# Altium project vidBoardV4.PrjPcb
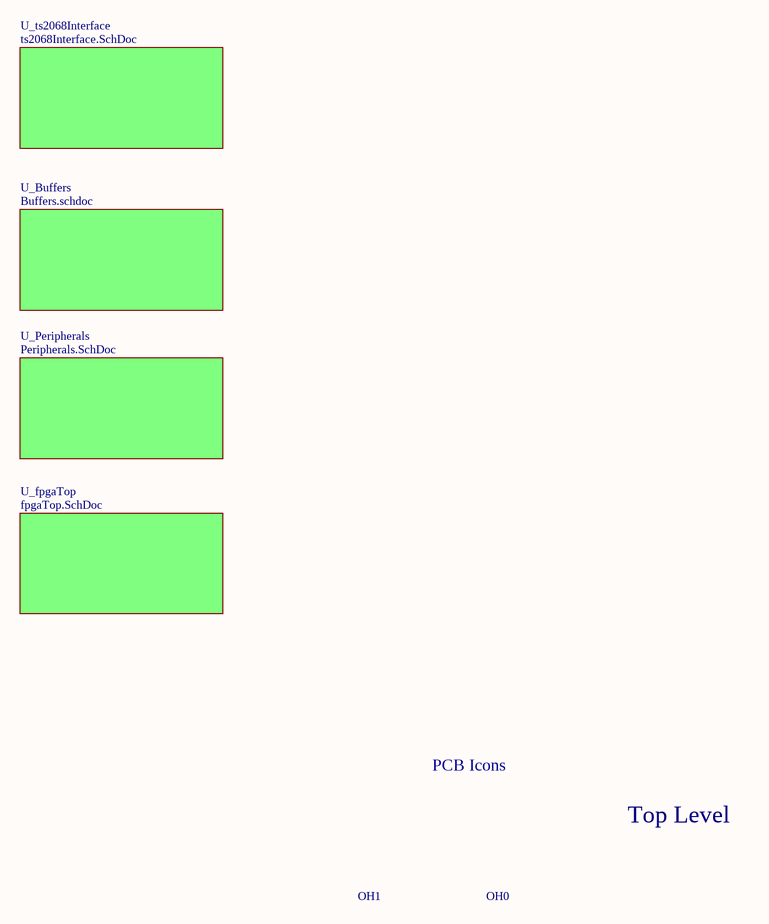
[diagram p0: vidBoardTop.SchDoc]
6 sheets, 103 parts. Net scope: global (net labels, ports and power ports of the same name join across sheets).
Sheets:
  vidBoardTop.SchDoc
    U_Peripherals = Peripherals.SchDoc
    U_ts2068Interface = ts2068Interface.SchDoc
    U_fpgaTop = fpgaTop.SchDoc
      U_fpgaPower = fpgaPower.SchDoc
      U_fpgaConfig = fpgaConfig.SchDoc

## Sheet vidBoardTop.SchDoc
size A; SheetNumber: 1; SheetTotal: 5

### Parts
OH0  OPENHW_PCB  [OpenHW]  (value not drawn)
OH1  OPENHW_SCH  (value not drawn)

### Sub-sheets
U_Buffers = Buffers.schdoc (file not in this document): no entries
U_fpgaTop = fpgaTop.SchDoc: no entries
U_Peripherals = Peripherals.SchDoc: no entries
U_ts2068Interface = ts2068Interface.SchDoc: no entries

### Notes on the sheet
- PCB Icons
- Top Level

## Sheet Peripherals.SchDoc
size A; SheetNumber: 4; SheetTotal: 5
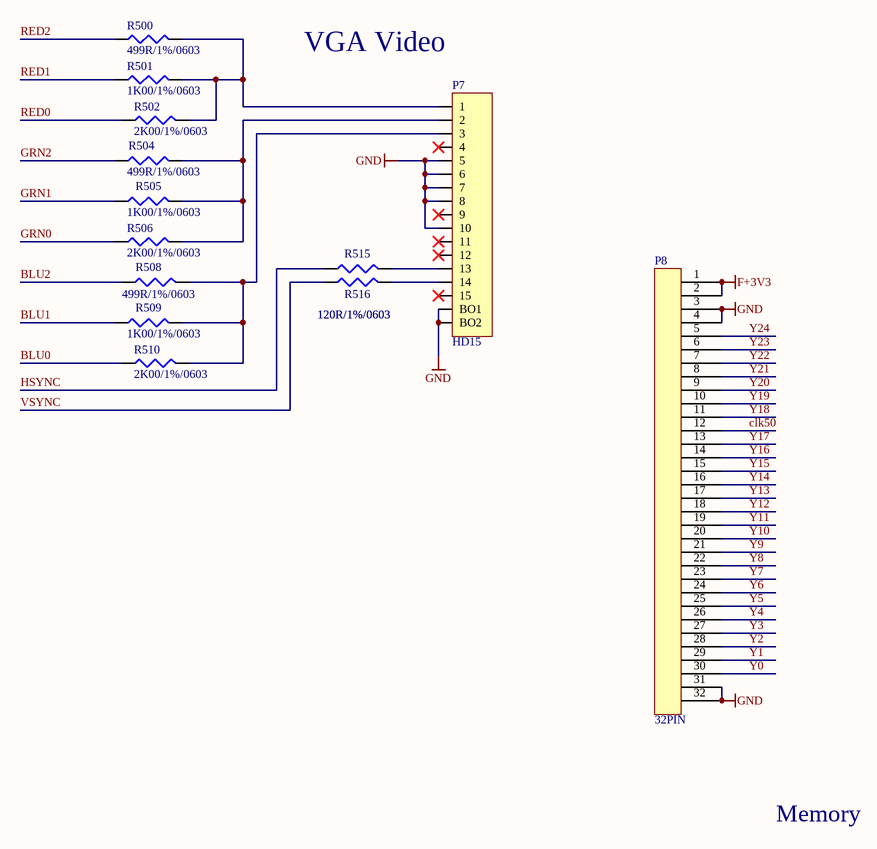
[diagram p1: Peripherals.SchDoc]

### Parts
P7  HD15  [DB15FLC]
P8  32PIN  [IDC32]
R500  499R/1%/0603  [0603]
R501  1K00/1%/0603  [0603]
R502  2K00/1%/0603  [0603]
R504  499R/1%/0603  [0603]
R505  1K00/1%/0603  [0603]
R506  2K00/1%/0603  [0603]
R508  499R/1%/0603  [0603]
R509  1K00/1%/0603  [0603]
R510  2K00/1%/0603  [0603]
R515  120R/1%/0603  [0603]
R516  120R/1%/0603  [0603]

### Nets
F+3V3: P8.1 P8.2
GND: P7.5 P7.6 P7.7 P7.8 P7.10 P7.BO1 P7.BO2 P8.3 P8.4 P8.31 P8.32
BLU0: R510.1
BLU1: R509.1
BLU2: R508.1
clk50: P8.12
GRN0: R506.1
GRN1: R505.1
GRN2: R504.1
HSYNC: R515.1
RED0: R502.1
RED1: R501.1
RED2: R500.1
VSYNC: R516.1
Y0: P8.30
Y1: P8.29
Y2: P8.28
Y3: P8.27
Y4: P8.26
Y5: P8.25
Y6: P8.24
Y7: P8.23
Y8: P8.22
Y9: P8.21
Y10: P8.20
Y11: P8.19
Y12: P8.18
Y13: P8.17
Y14: P8.16
Y15: P8.15
Y16: P8.14
Y17: P8.13
Y18: P8.11
Y19: P8.10
Y20: P8.9
Y21: P8.8
Y22: P8.7
Y23: P8.6
Y24: P8.5
NetP7_1: P7.1 R500.2 R501.2 R502.2
NetP7_2: P7.2 R504.2 R505.2 R506.2
NetP7_3: P7.3 R508.2 R509.2 R510.2
NetP7_13: P7.13 R515.2
NetP7_14: P7.14 R516.2

Not connected (* = marked no-connect by the designer): P7 4* 9* 11* 12* 15*

### Notes on the sheet
- (near P7) VGA Video
- Memory

### Library data of the parts
P7 = HD15: CONN DSUB HD RCPT 15POS R/A SLDR; Text Field1: Amphenol; Mfg PN: ICD15S13E4GX00LF; DK PN: 609-5181-ND
R500 R504 R508 = 499R/1%/0603: 499 Ohms ±1% 0.1W, 1/10W Chip Resistor 0603 (1608 Metric) Moisture Resistant Thick Film; MFG: Yeago; MFG PN: RC0603FR-07499RL; DK PN: 311-499HRCT-ND
R501 R505 R509 = 1K00/1%/0603: 1 kOhms ±1% 0.1W, 1/10W Chip Resistor 0603 (1608 Metric) Moisture Resistant Thick Film; MFG: Yeago; MFG PN: RC0603FR-071KL; DK PN: 311-1.00KHRCT-ND
R502 R506 R510 = 2K00/1%/0603: 2 kOhms ±1% 0.1W, 1/10W Chip Resistor 0603 (1608 Metric) Moisture Resistant Thick Film; MFG: Yeago; MFG PN: RC0603FR-072KL; DK PN: 311-2.00KHRCT-ND
R515 R516 = 120R/1%/0603: 120 Ohms ±1% 0.1W, 1/10W Chip Resistor 0603 (1608 Metric) Moisture Resistant Thick Film; MFG: Yaego; MFG PN: RC0603FR-07120RL; DK PN: 311-120HRCT-ND
P8 = 32PIN: MFG: *; MFG PN: *; DK PN: *; Price: *

## Sheet ts2068Interface.SchDoc
size A; SheetNumber: 2; SheetTotal: 5
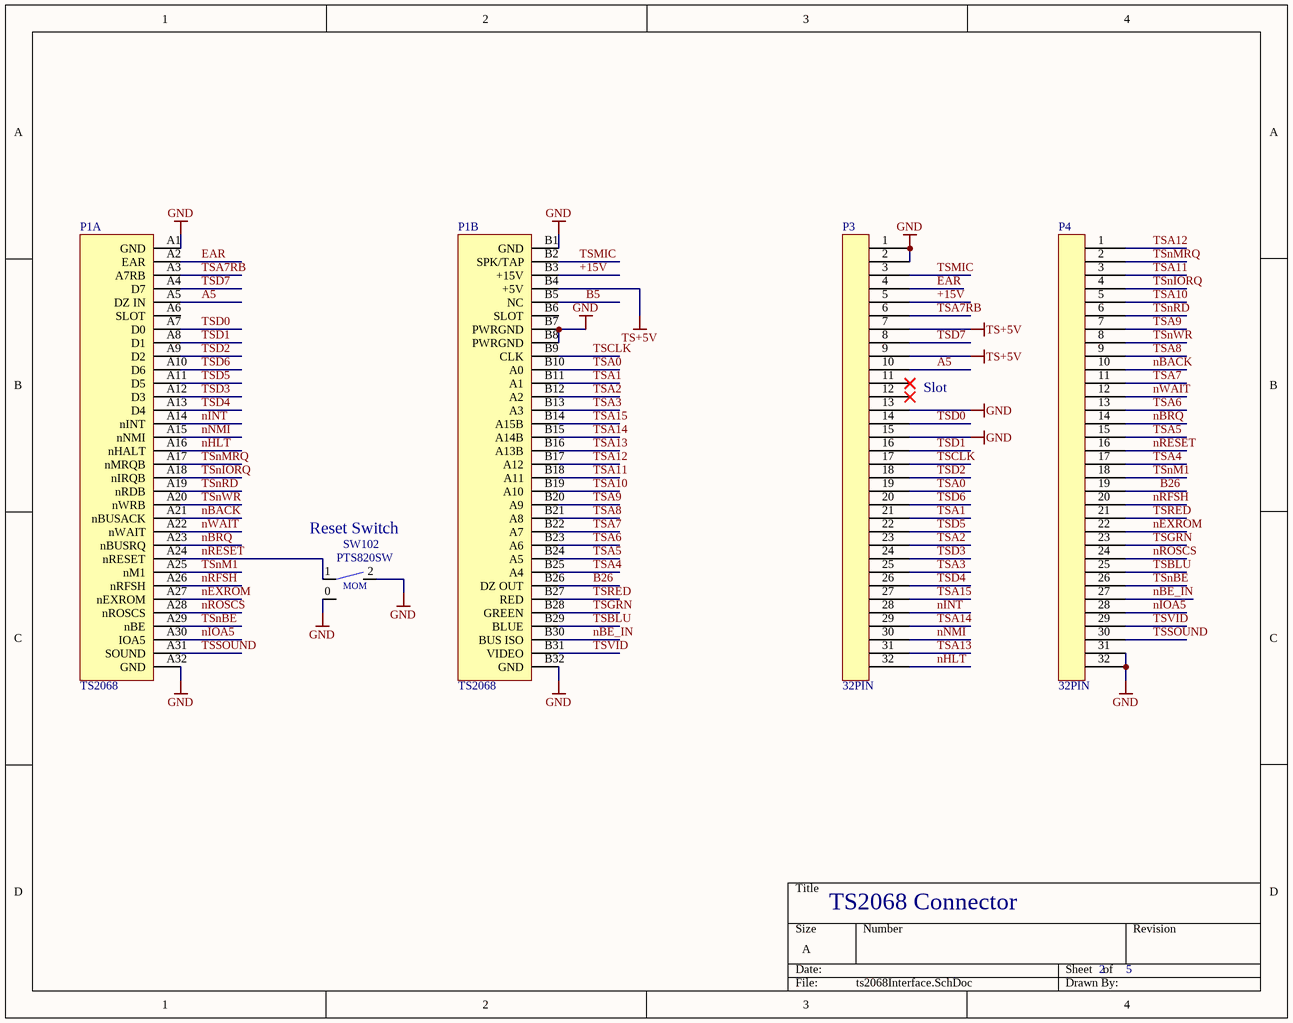
[diagram p2: ts2068Interface.SchDoc]

### Parts
P1  TS2068  [TS2068A]  (parts A,B of 2)
P3  32PIN  [IDC32]
P4  32PIN  [IDC32]
SW102  PTS820SW  [PTS820]

### Nets
GND: P1.A1(GND) P1.A32(GND) P1.B1(GND) P1.B7(PWRGND) P1.B8(PWRGND) P1.B32(GND) P3.1 P3.2 P3.13 P3.15 P4.31 P4.32 SW102.0 SW102.2
TS+5V: P1.B4(+5V) P3.7 P3.9
+15V: P1.B3(+15V) P3.5
A5: P1.A5(DZ_IN) P3.10
B5: P1.B5(NC)
B26: P1.B26(DZ_OUT) P4.19
EAR: P1.A2(EAR) P3.4
nBACK: P1.A21(nBUSACK) P4.10
nBE_IN: P1.B30(BUS_ISO) P4.27
nBRQ: P1.A23(nBUSRQ) P4.14
nEXROM: P1.A27(nEXROM) P4.22
nHLT: P1.A16(nHALT) P3.32
nINT: P1.A14(nINT) P3.28
nIOA5: P1.A30(IOA5) P4.28
nNMI: P1.A15(nNMI) P3.30
nRESET: P1.A24(nRESET) P4.16 SW102.1
nRFSH: P1.A26(nRFSH) P4.20
nROSCS: P1.A28(nROSCS) P4.24
nWAIT: P1.A22(nWAIT) P4.12
TSA0: P1.B10(A0) P3.19
TSA1: P1.B11(A1) P3.21
TSA2: P1.B12(A2) P3.23
TSA3: P1.B13(A3) P3.25
TSA4: P1.B25(A4) P4.17
TSA5: P1.B24(A5) P4.15
TSA6: P1.B23(A6) P4.13
TSA7: P1.B22(A7) P4.11
TSA7RB: P1.A3(A7RB) P3.6
TSA8: P1.B21(A8) P4.9
TSA9: P1.B20(A9) P4.7
TSA10: P1.B19(A10) P4.5
TSA11: P1.B18(A11) P4.3
TSA12: P1.B17(A12) P4.1
TSA13: P1.B16(A13B) P3.31
TSA14: P1.B15(A14B) P3.29
TSA15: P1.B14(A15B) P3.27
TSBLU: P1.B29(BLUE) P4.25
TSCLK: P1.B9(CLK) P3.17
TSD0: P1.A7(D0) P3.14
TSD1: P1.A8(D1) P3.16
TSD2: P1.A9(D2) P3.18
TSD3: P1.A12(D3) P3.24
TSD4: P1.A13(D4) P3.26
TSD5: P1.A11(D5) P3.22
TSD6: P1.A10(D6) P3.20
TSD7: P1.A4(D7) P3.8
TSGRN: P1.B28(GREEN) P4.23
TSMIC: P1.B2(SPK/TAP) P3.3
TSnBE: P1.A29(nBE) P4.26
TSnIORQ: P1.A18(nIRQB) P4.4
TSnM1: P1.A25(nM1) P4.18
TSnMRQ: P1.A17(nMRQB) P4.2
TSnRD: P1.A19(nRDB) P4.6
TSnWR: P1.A20(nWRB) P4.8
TSRED: P1.B27(RED) P4.21
TSSOUND: P1.A31(SOUND) P4.30
TSVID: P1.B31(VIDEO) P4.29

Not connected (* = marked no-connect by the designer): P1 A6(SLOT) B6(SLOT); P3 11* 12*

### Notes on the sheet
- Slot
- (near SW102) Reset Switch
- TS2068 Connector
- (in symbol PTS820SW) MOM

### Library data of the parts
SW102 = PTS820SW: Tactile Switch SPST-NO Top Actuated Surface Mount; MFG: C&K; MFG PN: PTS820 J20M SMTR LFS; DK PN: CKN10505CT-ND
P1 = TS2068: Populate: *
P3 P4 = 32PIN: MFG: *; MFG PN: *; DK PN: *; Price: *

## Sheet fpgaTop.SchDoc: FPGA Top Level
size A; SheetNumber: 1; SheetTotal: 3; PageSetup: Record=PageOptions|CenterHorizontal=True|CenterVertical=True|PrintScale=0.70|XCorrection=1.00|YCorrection=1.00|PrintKind=1|BorderSize=5000000|LeftOffset=0|BottomOffset=0|Orientation=2|PaperLength=2794|PaperWidth=2159|Scale=100|PaperSource=7|PrintQuality=600|MediaType=1|DitherType=10|PrintScaleMode=1|PaperKind=Letter|PaperIndex=1; DocumentName: Connectors
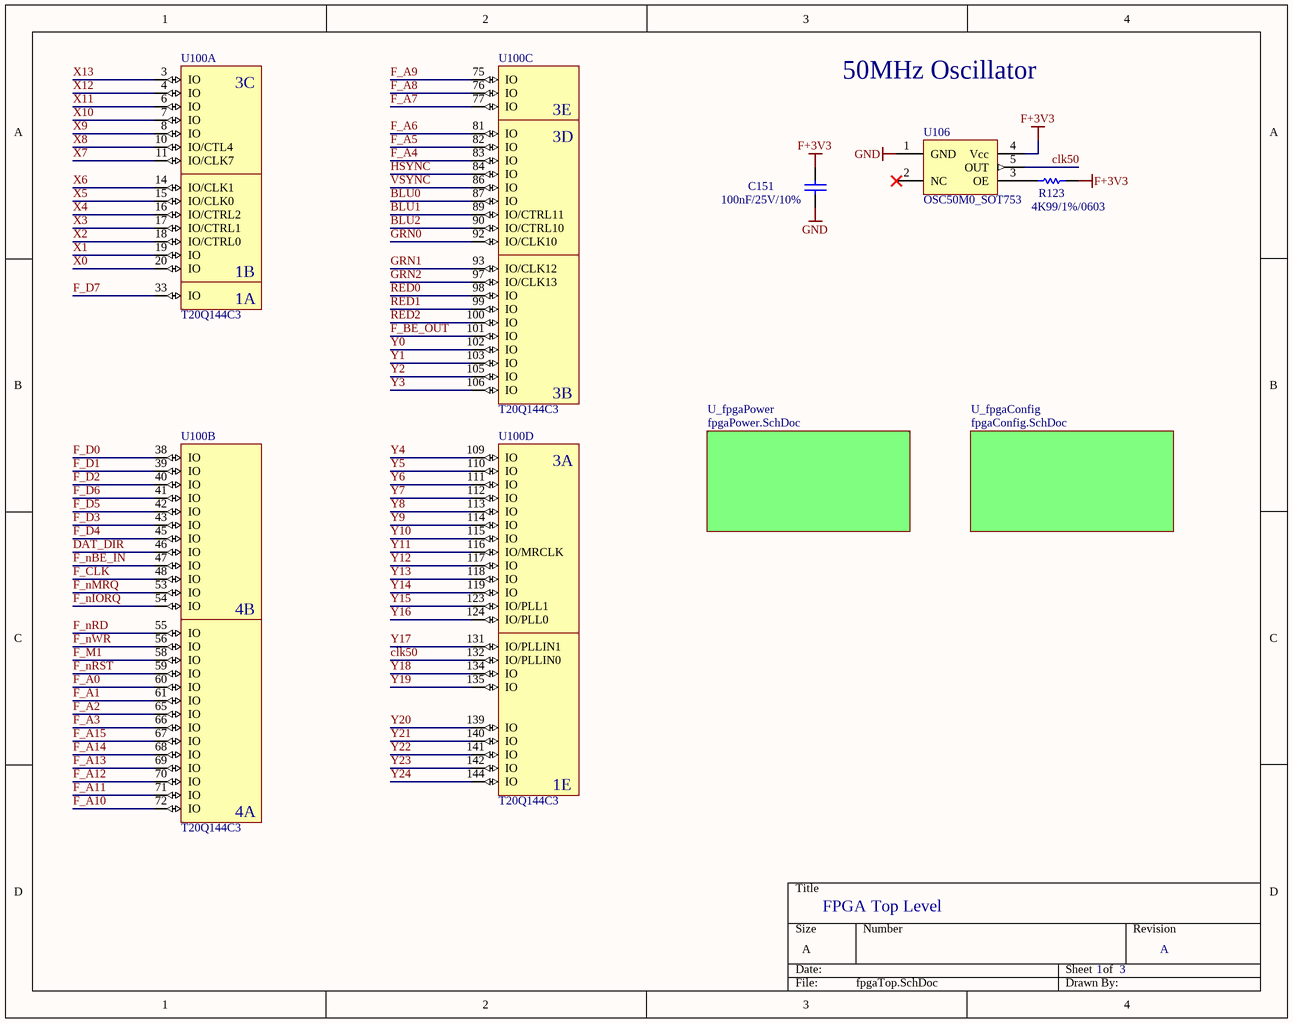
[diagram p3: fpgaTop.SchDoc]

### Parts
C151  100nF/25V/10%  [MY0603]
R123  4K99/1%/0603  [0603]
U100  T20Q144C3  [LQFP144]  (parts A,B,C,D of 6)
U106  OSC50M0_SOT753  [SOT753]

### Sub-sheets
U_fpgaConfig = fpgaConfig.SchDoc: no entries
U_fpgaPower = fpgaPower.SchDoc: no entries

### Nets
F+3V3: C151.2 R123.1 U106.4(Vcc)
GND: C151.1 U106.1(GND)
BLU0: U100.87(IO)
BLU1: U100.89(IO/CTRL11)
BLU2: U100.90(IO/CTRL10)
clk50: U100.132(IO/PLLIN0) U106.5(OUT)
DAT_DIR: U100.46(IO)
F_A0: U100.60(IO)
F_A1: U100.61(IO)
F_A2: U100.65(IO)
F_A3: U100.66(IO)
F_A4: U100.83(IO)
F_A5: U100.82(IO)
F_A6: U100.81(IO)
F_A7: U100.77(IO)
F_A8: U100.76(IO)
F_A9: U100.75(IO)
F_A10: U100.72(IO)
F_A11: U100.71(IO)
F_A12: U100.70(IO)
F_A13: U100.69(IO)
F_A14: U100.68(IO)
F_A15: U100.67(IO)
F_BE_OUT: U100.101(IO)
F_CLK: U100.48(IO)
F_D0: U100.38(IO)
F_D1: U100.39(IO)
F_D2: U100.40(IO)
F_D3: U100.43(IO)
F_D4: U100.45(IO)
F_D5: U100.42(IO)
F_D6: U100.41(IO)
F_D7: U100.33(IO)
F_M1: U100.58(IO)
F_nBE_IN: U100.47(IO)
F_nIORQ: U100.54(IO)
F_nMRQ: U100.53(IO)
F_nRD: U100.55(IO)
F_nRST: U100.59(IO)
F_nWR: U100.56(IO)
GRN0: U100.92(IO/CLK10)
GRN1: U100.93(IO/CLK12)
GRN2: U100.97(IO/CLK13)
HSYNC: U100.84(IO)
RED0: U100.98(IO)
RED1: U100.99(IO)
RED2: U100.100(IO)
VSYNC: U100.86(IO)
X0: U100.20(IO)
X1: U100.19(IO)
X2: U100.18(IO/CTRL0)
X3: U100.17(IO/CTRL1)
X4: U100.16(IO/CTRL2)
X5: U100.15(IO/CLK0)
X6: U100.14(IO/CLK1)
X7: U100.11(IO/CLK7)
X8: U100.10(IO/CTL4)
X9: U100.8(IO)
X10: U100.7(IO)
X11: U100.6(IO)
X12: U100.4(IO)
X13: U100.3(IO)
Y0: U100.102(IO)
Y1: U100.103(IO)
Y2: U100.105(IO)
Y3: U100.106(IO)
Y4: U100.109(IO)
Y5: U100.110(IO)
Y6: U100.111(IO)
Y7: U100.112(IO)
Y8: U100.113(IO)
Y9: U100.114(IO)
Y10: U100.115(IO)
Y11: U100.116(IO/MRCLK)
Y12: U100.117(IO)
Y13: U100.118(IO)
Y14: U100.119(IO)
Y15: U100.123(IO/PLL1)
Y16: U100.124(IO/PLL0)
Y17: U100.131(IO/PLLIN1)
Y18: U100.134(IO)
Y19: U100.135(IO)
Y20: U100.139(IO)
Y21: U100.140(IO)
Y22: U100.141(IO)
Y23: U100.142(IO)
Y24: U100.144(IO)
NetR123_2: R123.2 U106.3(OE)

Not connected (* = marked no-connect by the designer): U106 2(NC)*

### Notes on the sheet
- 50MHz Oscillator
- A
- (in symbol T20Q144C3, part A) 3C; 1B; 1A
- (in symbol T20Q144C3, part B) 4B; 4A
- (in symbol T20Q144C3, part C) 3E; 3D; 3B
- (in symbol T20Q144C3, part D) 3A; 1E

### Library data of the parts
C151 = CAP100NF25V: 0.1µF ±10% 25V Ceramic Capacitor X7R 0603 (1608 Metric); MFG PN: 06033C104KAT2A; DK PN: 478-3714-1-ND; MFG: AVX; FOOTPRINT: 0603; Populate: *
R123 = RES4K99: 4.99k Ohm ±1% 0.1W, 1/10W Chip Resistor 0603 (1608 Metric) Moisture Resistant Thick Film; MFG PN: RC0603FR-074K99L; DK PN: 311-4.99KHRTR-ND; MFG: Yageo; Populate: *; Comment_1: 4K99/1%/0603
U100 = T20Q144C3: Trion® Field Programmable Gate Array (FPGA) IC 97 1044 19728 144-LQFP; MFG: Efinix; DK PN: 2134-T20Q144C3-ND; MFG PN: T20Q144C3; FOOTPRINT: 144QFP; Populate: *
U106 = OSC50M0_SOT753: 50 MHz XO (Standard) HCMOS, LVCMOS Oscillator 2.5V ~ 3.3V Standby (Power Down) SC-74A, SOT-753; MFG PN: SIT2001BI-S3-XXS-50.000000; DK PN: 1473-SIT2001BI-S3-XXS-50.000000-ND; MFG: SiTime; Populate: *

## Sheet fpgaPower.SchDoc: FPGA Power
size A; SheetNumber: 3; SheetTotal: 3
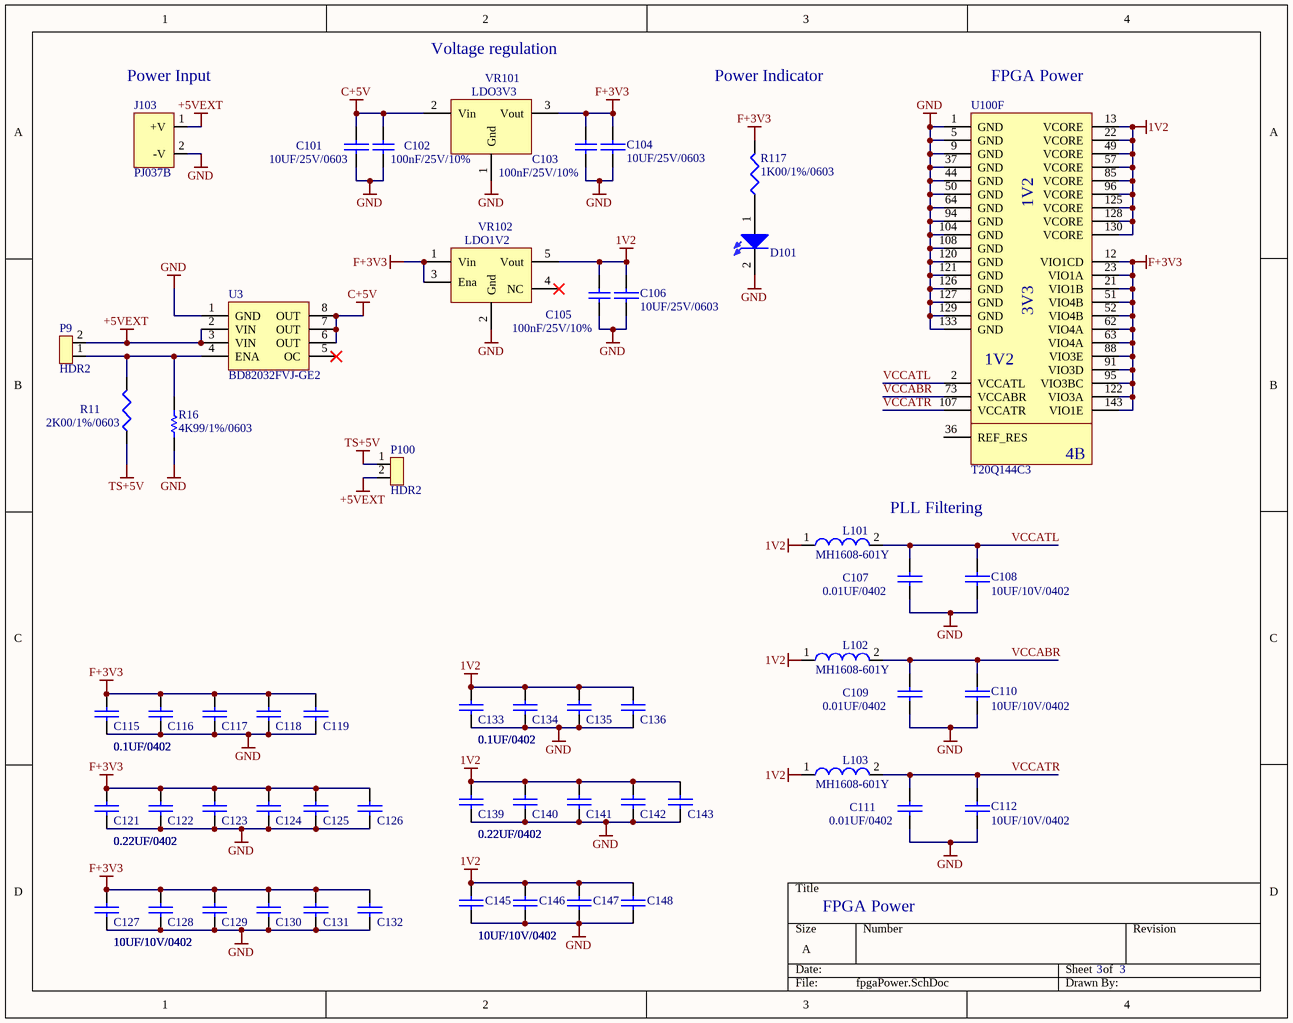
[diagram p4: fpgaPower.SchDoc]

### Parts
C101  10UF/25V/0603  [0603]
C102  100nF/25V/10%  [MY0603]
C103  100nF/25V/10%  [MY0603]
C104  10UF/25V/0603  [0603]
C105  100nF/25V/10%  [MY0603]
C106  10UF/25V/0603  [0603]
C107  0.01UF/0402  [0402]
C108  10UF/10V/0402  [0402]
C109  0.01UF/0402  [0402]
C110  10UF/10V/0402  [0402]
C111  0.01UF/0402  [0402]
C112  10UF/10V/0402  [0402]
C115  0.1UF/0402  [0402]
C116  0.1UF/0402  [0402]
C117  0.1UF/0402  [0402]
C118  0.1UF/0402  [0402]
C119  0.1UF/0402  [0402]
C121  0.22UF/0402  [0402]
C122  0.22UF/0402  [0402]
C123  0.22UF/0402  [0402]
C124  0.22UF/0402  [0402]
C125  0.22UF/0402  [0402]
C126  0.22UF/0402  [0402]
C127  10UF/10V/0402  [0402]
C128  10UF/10V/0402  [0402]
C129  10UF/10V/0402  [0402]
C130  10UF/10V/0402  [0402]
C131  10UF/10V/0402  [0402]
C132  10UF/10V/0402  [0402]
C133  0.1UF/0402  [0402]
C134  0.1UF/0402  [0402]
C135  0.1UF/0402  [0402]
C136  0.1UF/0402  [0402]
C139  0.22UF/0402  [0402]
C140  0.22UF/0402  [0402]
C141  0.22UF/0402  [0402]
C142  0.22UF/0402  [0402]
C143  0.22UF/0402  [0402]
C145  10UF/10V/0402  [0402]
C146  10UF/10V/0402  [0402]
C147  10UF/10V/0402  [0402]
C148  10UF/10V/0402  [0402]
D101  LTST-C191KGKT  [LED0603]  (value not drawn)
J103  PJ037B  [PJ037B]
L101  MH1608-601Y  [0603]
L102  MH1608-601Y  [0603]
L103  MH1608-601Y  [0603]
P9  HDR2  [HDR2]
P100  HDR2  [HDR2]
R11  2K00/1%/0603  [0603]
R16  4K99/1%/0603  [0603]
R117  1K00/1%/0603  [0603]
U3  BD82032FVJ-GE2  [TSSOP8-A]
U100  T20Q144C3  [LQFP144]  (part F of 6)
VR101  LDO3V3  [DPAK]
VR102  LDO1V2  [SOT23-5]

### Nets
1V2: C105.2 C106.1 C133.1 C134.1 C135.1 C136.1 C139.1 C140.1 C141.1 C142.1 C143.1 C145.1 C146.1 C147.1 C148.1 L101.1 L102.1 L103.1 U100.13(VCORE) U100.22(VCORE) U100.49(VCORE) U100.57(VCORE) U100.85(VCORE) U100.96(VCORE) U100.125(VCORE) U100.128(VCORE) U100.130(VCORE) VR102.5(Vout)
+5VEXT: J103.1(+V) P9.2 P100.2 U3.2(VIN) U3.3(VIN)
C+5V: C101.1 C102.2 U3.6(OUT) U3.7(OUT) U3.8(OUT) VR101.2(Vin)
F+3V3: C103.2 C104.1 C115.1 C116.1 C117.1 C118.1 C119.1 C121.1 C122.1 C123.1 C124.1 C125.1 C126.1 C127.1 C128.1 C129.1 C130.1 C131.1 C132.1 R117.2 U100.12(VIO1CD) U100.21(VIO1B) U100.23(VIO1A) U100.51(VIO4B) U100.52(VIO4B) U100.62(VIO4A) U100.63(VIO4A) U100.88(VIO3E) U100.91(VIO3D) U100.95(VIO3BC) U100.122(VIO3A) U100.143(VIO1E) VR101.3(Vout) VR102.1(Vin) VR102.3(Ena)
GND: C101.2 C102.1 C103.1 C104.2 C105.1 C106.2 C107.2 C108.2 C109.2 C110.2 C111.2 C112.2 C115.2 C116.2 C117.2 C118.2 C119.2 C121.2 C122.2 C123.2 C124.2 C125.2 C126.2 C127.2 C128.2 C129.2 C130.2 C131.2 C132.2 C133.2 C134.2 C135.2 C136.2 C139.2 C140.2 C141.2 C142.2 C143.2 C145.2 C146.2 C147.2 C148.2 D101.2(K) J103.2(-V) R16.1 U3.1(GND) U100.1(GND) U100.5(GND) U100.9(GND) U100.37(GND) U100.44(GND) U100.50(GND) U100.64(GND) U100.94(GND) U100.104(GND) U100.108(GND) U100.120(GND) U100.121(GND) U100.126(GND) U100.127(GND) U100.129(GND) U100.133(GND) VR101.1(Gnd) VR102.2(Gnd)
TS+5V: P100.1 R11.1
VCCABR: C109.1 C110.1 L102.2 U100.73(VCCABR)
VCCATL: C107.1 C108.1 L101.2 U100.2(VCCATL)
VCCATR: C111.1 C112.1 L103.2 U100.107(VCCATR)
NetD101_1: D101.1(A) R117.1
NetP9_1: P9.1 R11.2 R16.2 U3.4(ENA)

Not connected (* = marked no-connect by the designer): U3 5(OC)*; U100 36(REF_RES); VR102 4(NC)*

### Notes on the sheet
- (near J103) Power Input
- Voltage regulation
- Power Indicator
- (near U100) FPGA Power
- PLL Filtering
- (in symbol T20Q144C3, part F) 1V2; 3V3; 4B

### Library data of the parts
C101 C104 C106 = 10UF/25V/0603: 10 µF ±20% 25V Ceramic Capacitor X5R 0603 (1608 Metric); MFG: Samsung; MFG PN: CL10A106MA8NRNC; DK PN: 1276-1869-1-ND; Price: 1.17
C102 C103 C105 = CAP100NF25V: as C151 on sheet fpgaTop; FOOTPRINT: 0603; Populate: *
C107 C109 C111 = 0.01UF/16vV/0402: ±10% 16V Ceramic Capacitor X7R 0402 (1005 Metric); MFG: Cal-Chip; MFG PN: GMC04X7R103K16NT; DK PN: 2571-GMC04X7R103K16NTTR-ND; Price: 1.17
C108 C110 C112 C127-C132 C145-C148 = 10UF/10V/0402: ±20% 10V Ceramic Capacitor X5R 0402 (1005 Metric); MFG: Samsung; MFG PN: CL05A106MP8NUB8; DK PN: 1276-6830-1-ND; Price: 1.17
C115-C119 C133-C136 = 0.1UF/16v/0402: ±10% 16V Ceramic Capacitor X7R 0402 (1005 Metric); MFG: TDK; MFG PN: CGA2B1X7R1C104K050BC; DK PN: 445-5613-1-ND; Price: 1.17
C121-C126 C139-C143 = 0.22UF/0402: 0.22 µF ±10% 25V Ceramic Capacitor X5R 0402 (1005 Metric); MFG: Yaego; MFG PN: CC0402KRX5R8BB224; DK PN: 311-3341-1-ND; Price: 1.17
D101 = LTST-C191KGKT: Green 571nm LED Indication - Discrete 2V 0603 (1608 Metric); DK PN: 160-1446-1-ND; MFG: Liteon; MFG PN: LTST-C191KGKT; Populate: *
J103 = PJ037B: Power Barrel Connector Jack 2.50mm ID (0.098"), 5.50mm OD (0.217") Through Hole, Right Angle; MFG PN: PJ-037B; DK PN: CP-037B-ND; MFG: CUI
L101-L103 = MH1608-601Y: 600 Ohms @ 100 MHz 1 Power, Signal Line Ferrite Bead 0603 (1608 Metric) 1A 200mOhm; MFG: Bourns; DK PN: MH1608-601YCT-ND; MFG PN: MH1608-601Y
R11 = 2K00/1%/0603: as R502 on sheet Peripherals
R16 = RES4K99: as R123 on sheet fpgaTop; Populate: *; Comment_1: 4K99/1%/0603
R117 = 1K00/1%/0603: as R501 on sheet Peripherals
U3 = BD82032FVJ-GE2: Power Switch/Driver 1:1 N-Channel 2A 8-TSSOP-BJ; DK PN: BD82032FVJ-GE2CT-ND; MFG: Rohm; MFG PN: BD82032FVJ-GE2; FOOTPRINT: TO252; Populate: *
U100 = T20Q144C3: as U100 on sheet fpgaTop; MFG PN: T20Q144C3; FOOTPRINT: 144QFP; Populate: *
VR101 = LDO3V3: Linear Voltage Regulator IC Positive Fixed 1 Output 1.5A DPAK; MFG PN: LD1086DT33TR; DK PN: 497-3446-1-ND; MFG: STM; Populate: *; Comment_1: LDO3V3
VR102 = LDO1V2: Linear Voltage Regulator IC Positive Fixed 1 Output 1.5A DPAK; MFG PN: NCP114ASN120T1G; DK PN: NCP114ASN120T1GOSCT-ND; MFG: On Semi; FOOTPRINT: 5TSOP; Populate: *; Comment_1: LDO1V2

## Sheet fpgaConfig.SchDoc: FPGA Configurtion
size A; SheetNumber: 2; SheetTotal: 3
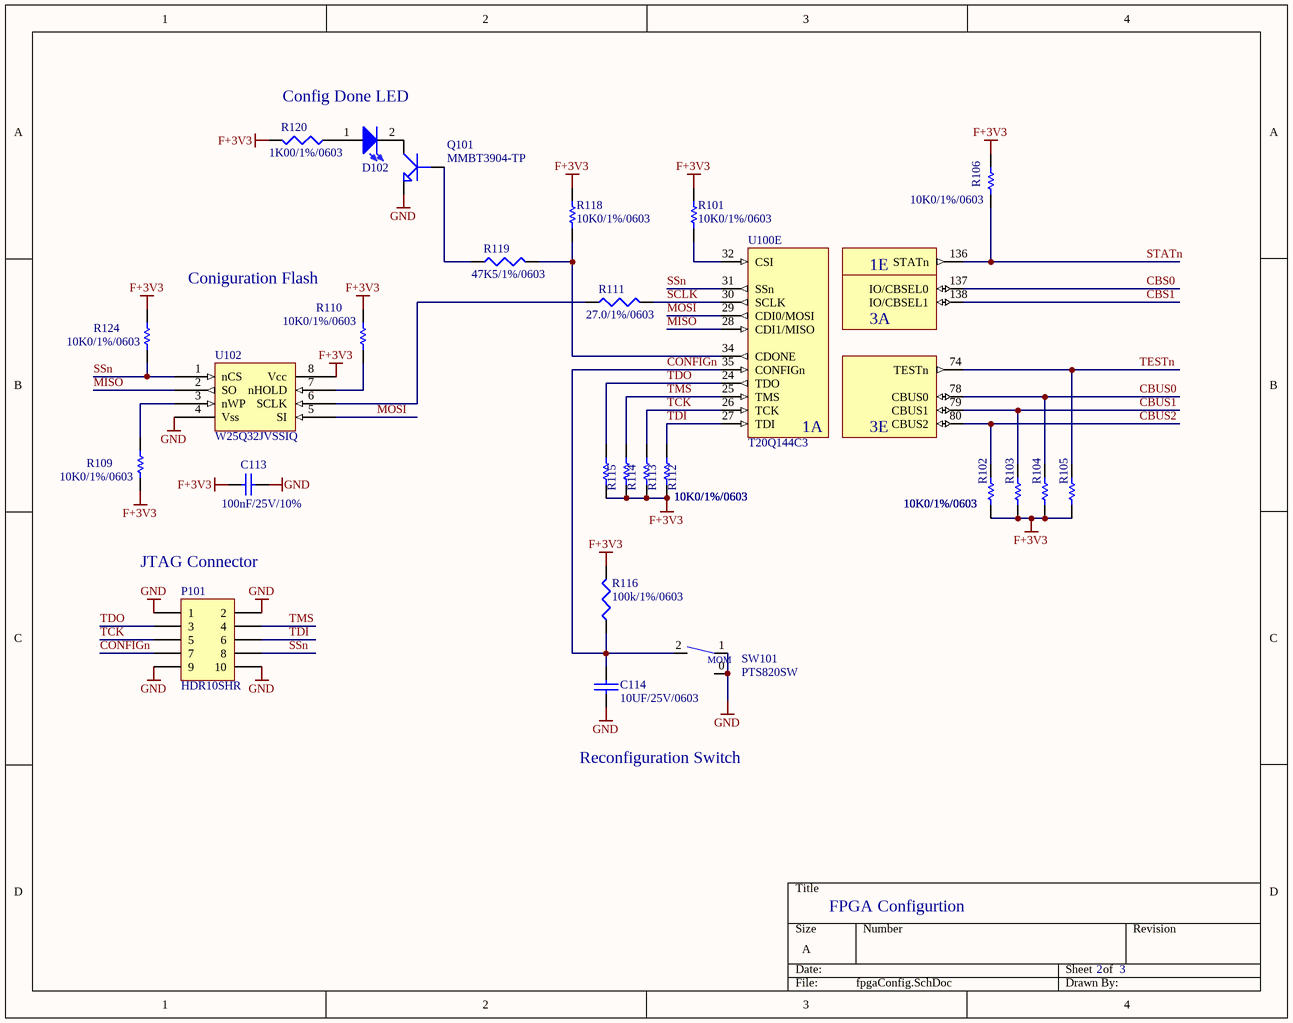
[diagram p5: fpgaConfig.SchDoc]

### Parts
C113  100nF/25V/10%  [MY0603]
C114  10UF/25V/0603  [0603]
D102  LTST-C191KGKT  [LED0603]  (value not drawn)
P101  HDR10SHR  [HDR10]
Q101  MMBT3904-TP  [SOT-23]
R101  10K0/1%/0603  [0603]
R102  10K0/1%/0603  [0603]
R103  10K0/1%/0603  [0603]
R104  10K0/1%/0603  [0603]
R105  10K0/1%/0603  [0603]
R106  10K0/1%/0603  [0603]
R109  10K0/1%/0603  [0603]
R110  10K0/1%/0603  [0603]
R111  27.0/1%/0603  [0603]
R112  10K0/1%/0603  [0603]
R113  10K0/1%/0603  [0603]
R114  10K0/1%/0603  [0603]
R115  10K0/1%/0603  [0603]
R116  100k/1%/0603  [0603]
R118  10K0/1%/0603  [0603]
R119  47K5/1%/0603  [0603]
R120  1K00/1%/0603  [0603]
R124  10K0/1%/0603  [0603]
SW101  PTS820SW  [PTS820]
U100  T20Q144C3  [LQFP144]  (part E of 6)
U102  W25Q32JVSSIQ  [so8w]

### Nets
F+3V3: C113.2 R101.2 R102.1 R103.1 R104.1 R105.1 R106.2 R109.1 R110.1 R112.1 R113.1 R114.1 R115.1 R116.2 R118.2 R120.2 R124.2 U102.8(Vcc)
GND: C113.1 C114.2 P101.1 P101.2 P101.9 P101.10 Q101.2(EMITTER) SW101.0 SW101.1 U102.4(Vss)
CBS0: U100.137(IO/CBSEL0)
CBS1: U100.138(IO/CBSEL1)
CBUS0: R104.2 U100.78(CBUS0)
CBUS1: R103.2 U100.79(CBUS1)
CBUS2: R102.2 U100.80(CBUS2)
CONFIGn: C114.1 P101.7 R116.1 SW101.2 U100.35(CONFIGn)
MISO: U100.28(CDI1/MISO) U102.2(SO)
MOSI: U100.29(CDI0/MOSI) U102.5(SI)
SCLK: R111.2 U100.30(SCLK)
SSn: P101.8 R124.1 U100.31(SSn) U102.1(nCS)
STATn: R106.1 U100.136(STATn)
TCK: P101.5 R113.2 U100.26(TCK)
TDI: P101.6 R112.2 U100.27(TDI)
TDO: P101.3 R115.2 U100.24(TDO)
TESTn: R105.2 U100.74(TESTn)
TMS: P101.4 R114.2 U100.25(TMS)
NetD102_1: D102.1(A) R120.1
NetD102_2: D102.2(K) Q101.3(COLLECTOR)
NetQ101_1: Q101.1(BASE) R119.1
NetR101_1: R101.1 U100.32(CSI)
NetR109_2: R109.2 U102.3(nWP)
NetR110_2: R110.2 U102.7(nHOLD)
NetR111_1: R111.1 U102.6(SCLK)
NetR118_1: R118.1 R119.2 U100.34(CDONE)

### Notes on the sheet
- Config Done LED
- Coniguration Flash
- (near P101) JTAG Connector
- Reconfiguration Switch
- (in symbol PTS820SW) MOM
- (in symbol T20Q144C3, part E) 1E; 3A; 1A; 3E

### Library data of the parts
C113 = CAP100NF25V: as C151 on sheet fpgaTop; FOOTPRINT: 0603; Populate: *
C114 = 10UF/25V/0603: as C101 on sheet fpgaPower; Price: 1.17
D102 = LTST-C191KGKT: as D101 on sheet fpgaPower; MFG PN: LTST-C191KGKT; Populate: *
P101 = HDR10SHR: Connector Header Through Hole 10 position 0.100" (2.54mm); MFG: On Shore; MFG PN: 302-S101; DK PN: ED1543-ND; Populate: *
Q101 = MMBT3904-TP: Bipolar (BJT) Transistor NPN 40 V 200 mA 300MHz 350 mW Surface Mount SOT-23; MFG: Micro Commercial; DK PN: MMBT3904TPMSCT-ND; MFG PN: MMBT3904-TP; Price: 0.58000
R101-R106 R109 R110 R112-R115 R118 R124 = RES10K0: 10k Ohm ±1% 0.1W, 1/10W Chip Resistor 0603 (1608 Metric) Moisture Resistant Thick Film; MFG PN: RC0603FR-0710KL; DK PN: 311-10.0KHRTR-ND; MFG: Yageo; Populate: *
R111 = 27.0/1%/0603: 27 Ohms ±1% 0.1W, 1/10W Chip Resistor 0603 (1608 Metric) Moisture Resistant Thick Film; MFG: Yeago; MFG PN: RC0603FR-0727RL; DK PN: 311-27.0HRCT-ND
R116 = 100k/1%/0603: 100 kOhms ±1% 0.1W, 1/10W Chip Resistor 0603 (1608 Metric) Moisture Resistant Thick Film; MFG: Yeago; MFG PN: RC0603FR-07100KL; DK PN: 311-100KHRCT-ND
R119 = 47K5/1%/0603: 47.5 kOhms ±1% 0.1W, 1/10W Chip Resistor 0603 (1608 Metric) Moisture Resistant Thick Film; MFG: Yeago; MFG PN: RC0603FR-0747K5L; DK PN: 311-47.5KHRCT-ND
R120 = 1K00/1%/0603: as R501 on sheet Peripherals
SW101 = PTS820SW: as SW102 on sheet ts2068Interface
U100 = T20Q144C3: as U100 on sheet fpgaTop; MFG PN: T20Q144C3; FOOTPRINT: 144QFP; Populate: *
U102 = W25Q32JVSSIQ: FLASH - NOR Memory IC 32Mb (4M x 8) SPI - Quad I/O 133 MHz 8-SOIC; MFG: Winbond; MFG PN: W25Q32JVSSIQ TR; DK PN: W25Q32JVSSIQCT-ND

## Nets that join several sheets
F+3V3: Peripherals (P8.1 P8.2), fpgaTop (C151.2 R123.1 U106.4), fpgaPower (35 pins), fpgaConfig (18 pins)
GND: Peripherals (11 pins), ts2068Interface (14 pins), fpgaTop (C151.1 U106.1), fpgaPower (64 pins), fpgaConfig (10 pins)
TS+5V: ts2068Interface (P1.B4 P3.7 P3.9), fpgaPower (P100.1 R11.1)
BLU0: Peripherals (R510.1), fpgaTop (U100.87)
BLU1: Peripherals (R509.1), fpgaTop (U100.89)
BLU2: Peripherals (R508.1), fpgaTop (U100.90)
clk50: Peripherals (P8.12), fpgaTop (U100.132 U106.5)
GRN0: Peripherals (R506.1), fpgaTop (U100.92)
GRN1: Peripherals (R505.1), fpgaTop (U100.93)
GRN2: Peripherals (R504.1), fpgaTop (U100.97)
HSYNC: Peripherals (R515.1), fpgaTop (U100.84)
RED0: Peripherals (R502.1), fpgaTop (U100.98)
RED1: Peripherals (R501.1), fpgaTop (U100.99)
RED2: Peripherals (R500.1), fpgaTop (U100.100)
VSYNC: Peripherals (R516.1), fpgaTop (U100.86)
Y0: Peripherals (P8.30), fpgaTop (U100.102)
Y1: Peripherals (P8.29), fpgaTop (U100.103)
Y2: Peripherals (P8.28), fpgaTop (U100.105)
Y3: Peripherals (P8.27), fpgaTop (U100.106)
Y4: Peripherals (P8.26), fpgaTop (U100.109)
Y5: Peripherals (P8.25), fpgaTop (U100.110)
Y6: Peripherals (P8.24), fpgaTop (U100.111)
Y7: Peripherals (P8.23), fpgaTop (U100.112)
Y8: Peripherals (P8.22), fpgaTop (U100.113)
Y9: Peripherals (P8.21), fpgaTop (U100.114)
Y10: Peripherals (P8.20), fpgaTop (U100.115)
Y11: Peripherals (P8.19), fpgaTop (U100.116)
Y12: Peripherals (P8.18), fpgaTop (U100.117)
Y13: Peripherals (P8.17), fpgaTop (U100.118)
Y14: Peripherals (P8.16), fpgaTop (U100.119)
Y15: Peripherals (P8.15), fpgaTop (U100.123)
Y16: Peripherals (P8.14), fpgaTop (U100.124)
Y17: Peripherals (P8.13), fpgaTop (U100.131)
Y18: Peripherals (P8.11), fpgaTop (U100.134)
Y19: Peripherals (P8.10), fpgaTop (U100.135)
Y20: Peripherals (P8.9), fpgaTop (U100.139)
Y21: Peripherals (P8.8), fpgaTop (U100.140)
Y22: Peripherals (P8.7), fpgaTop (U100.141)
Y23: Peripherals (P8.6), fpgaTop (U100.142)
Y24: Peripherals (P8.5), fpgaTop (U100.144)